# EasyEDA Pro project 3轴6.1--esp32 -(7-2).eprj, board PCB
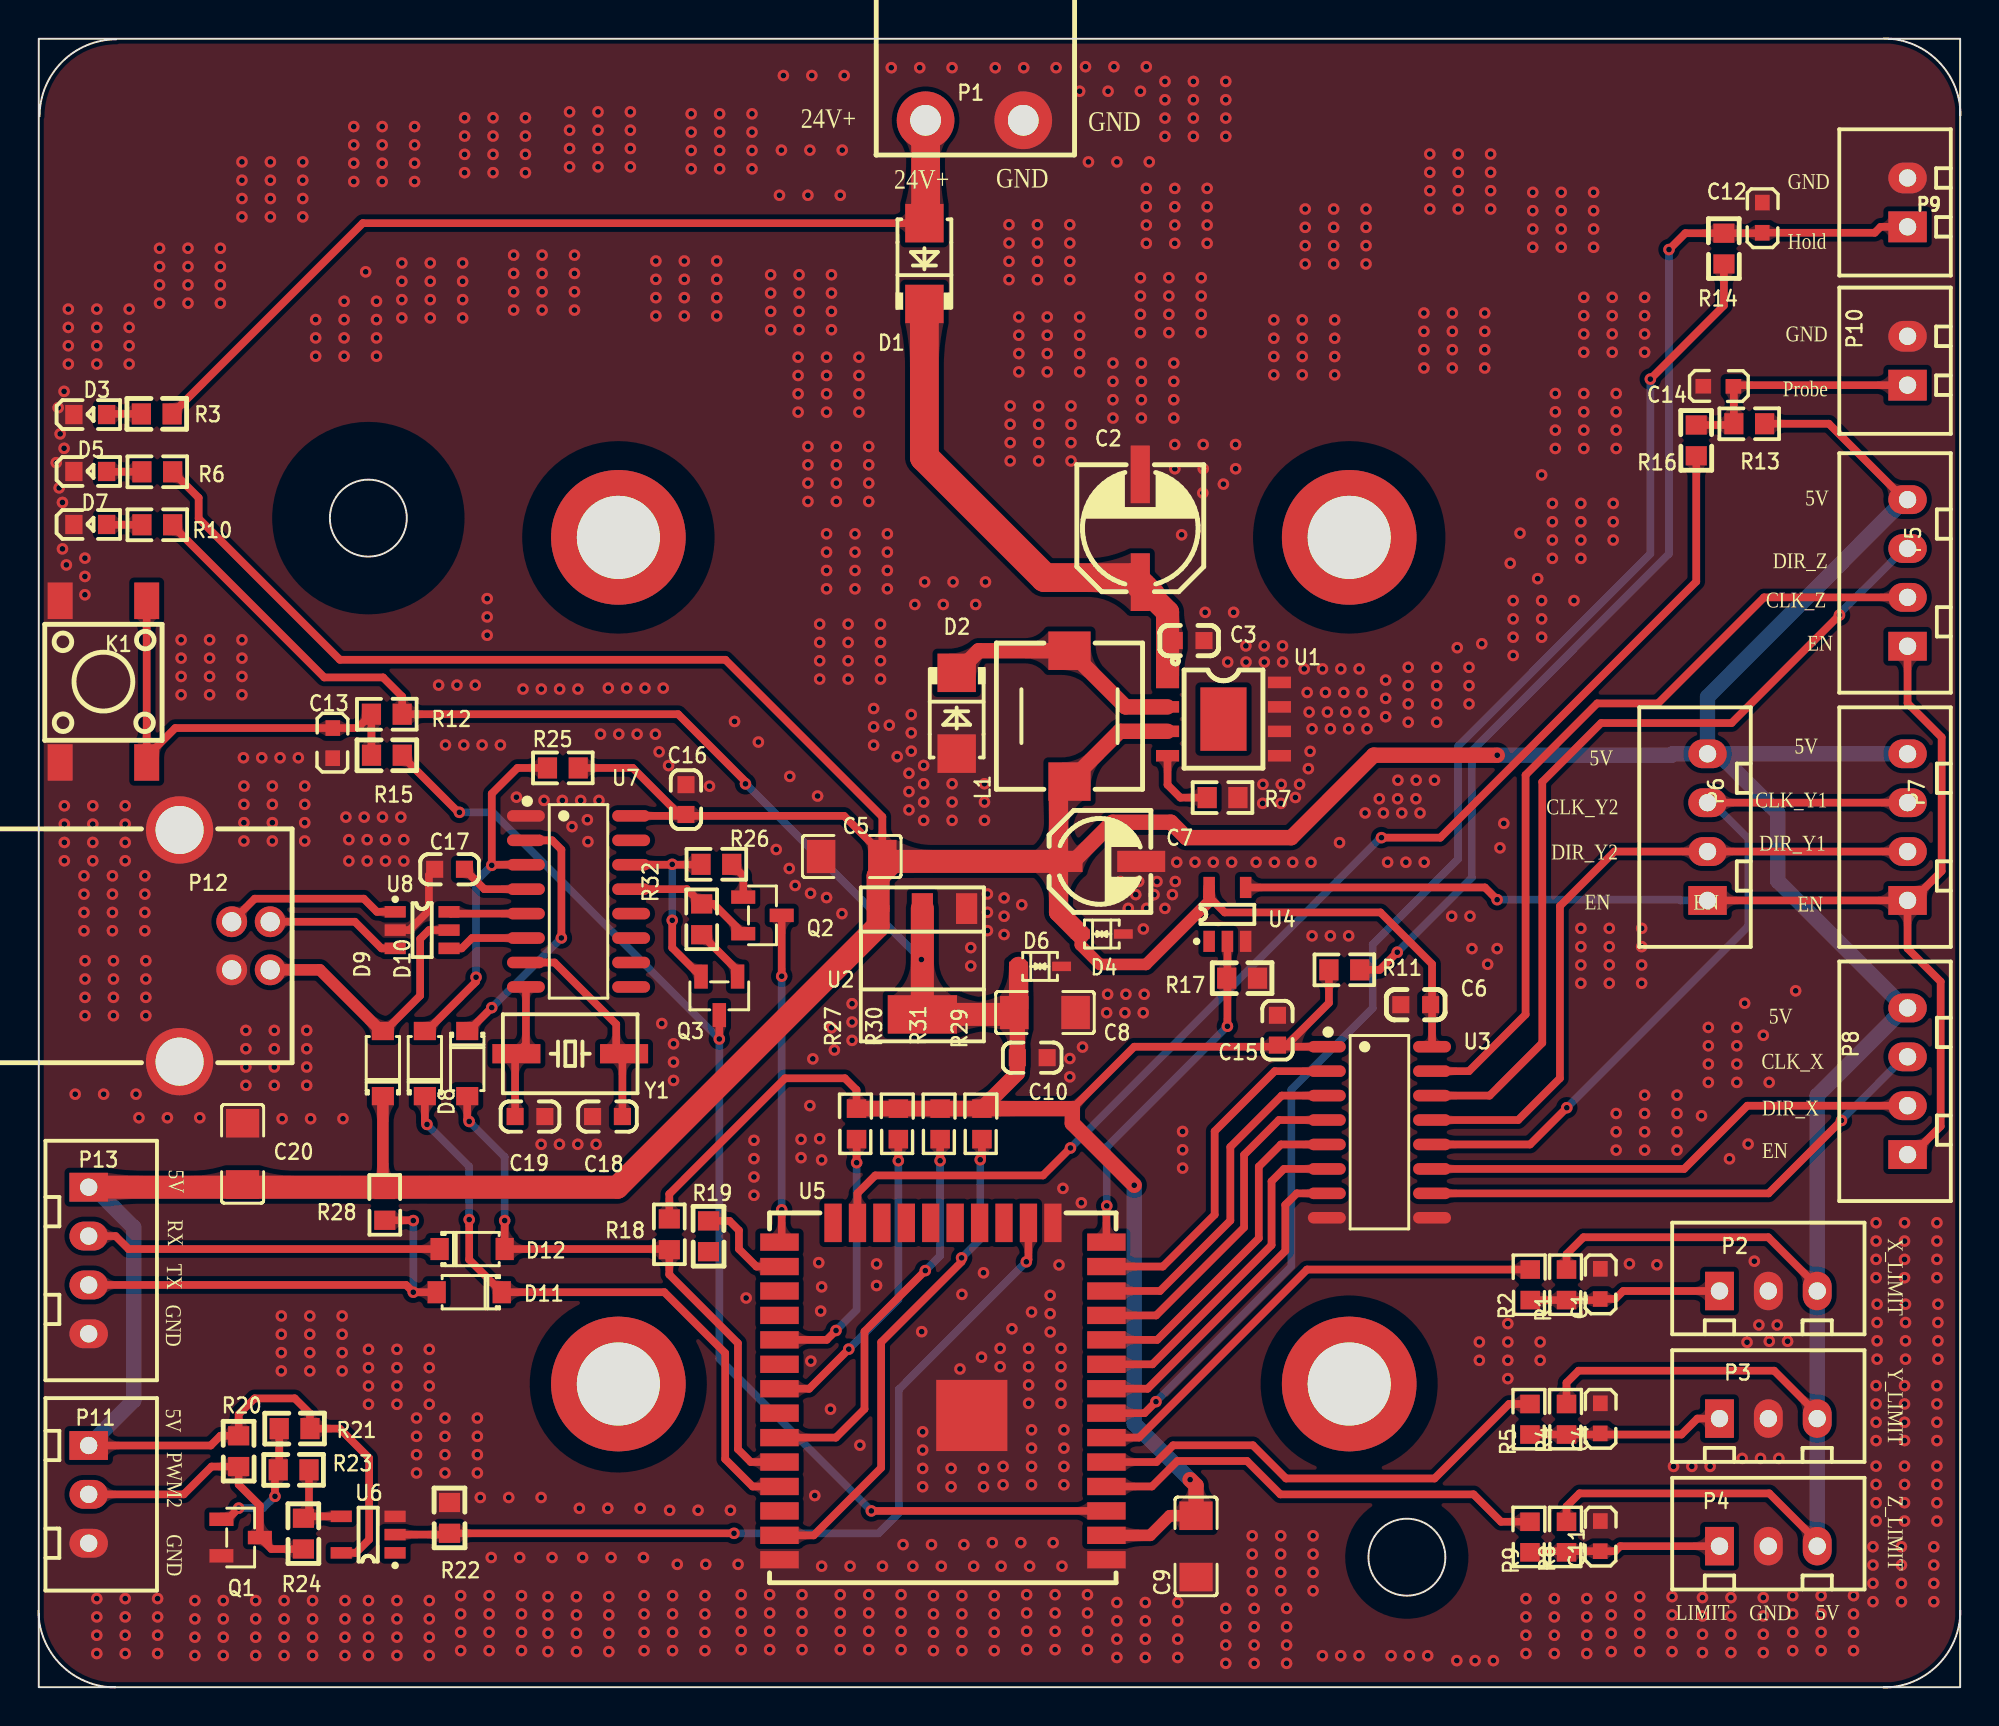
[diagram p1: board, top side]
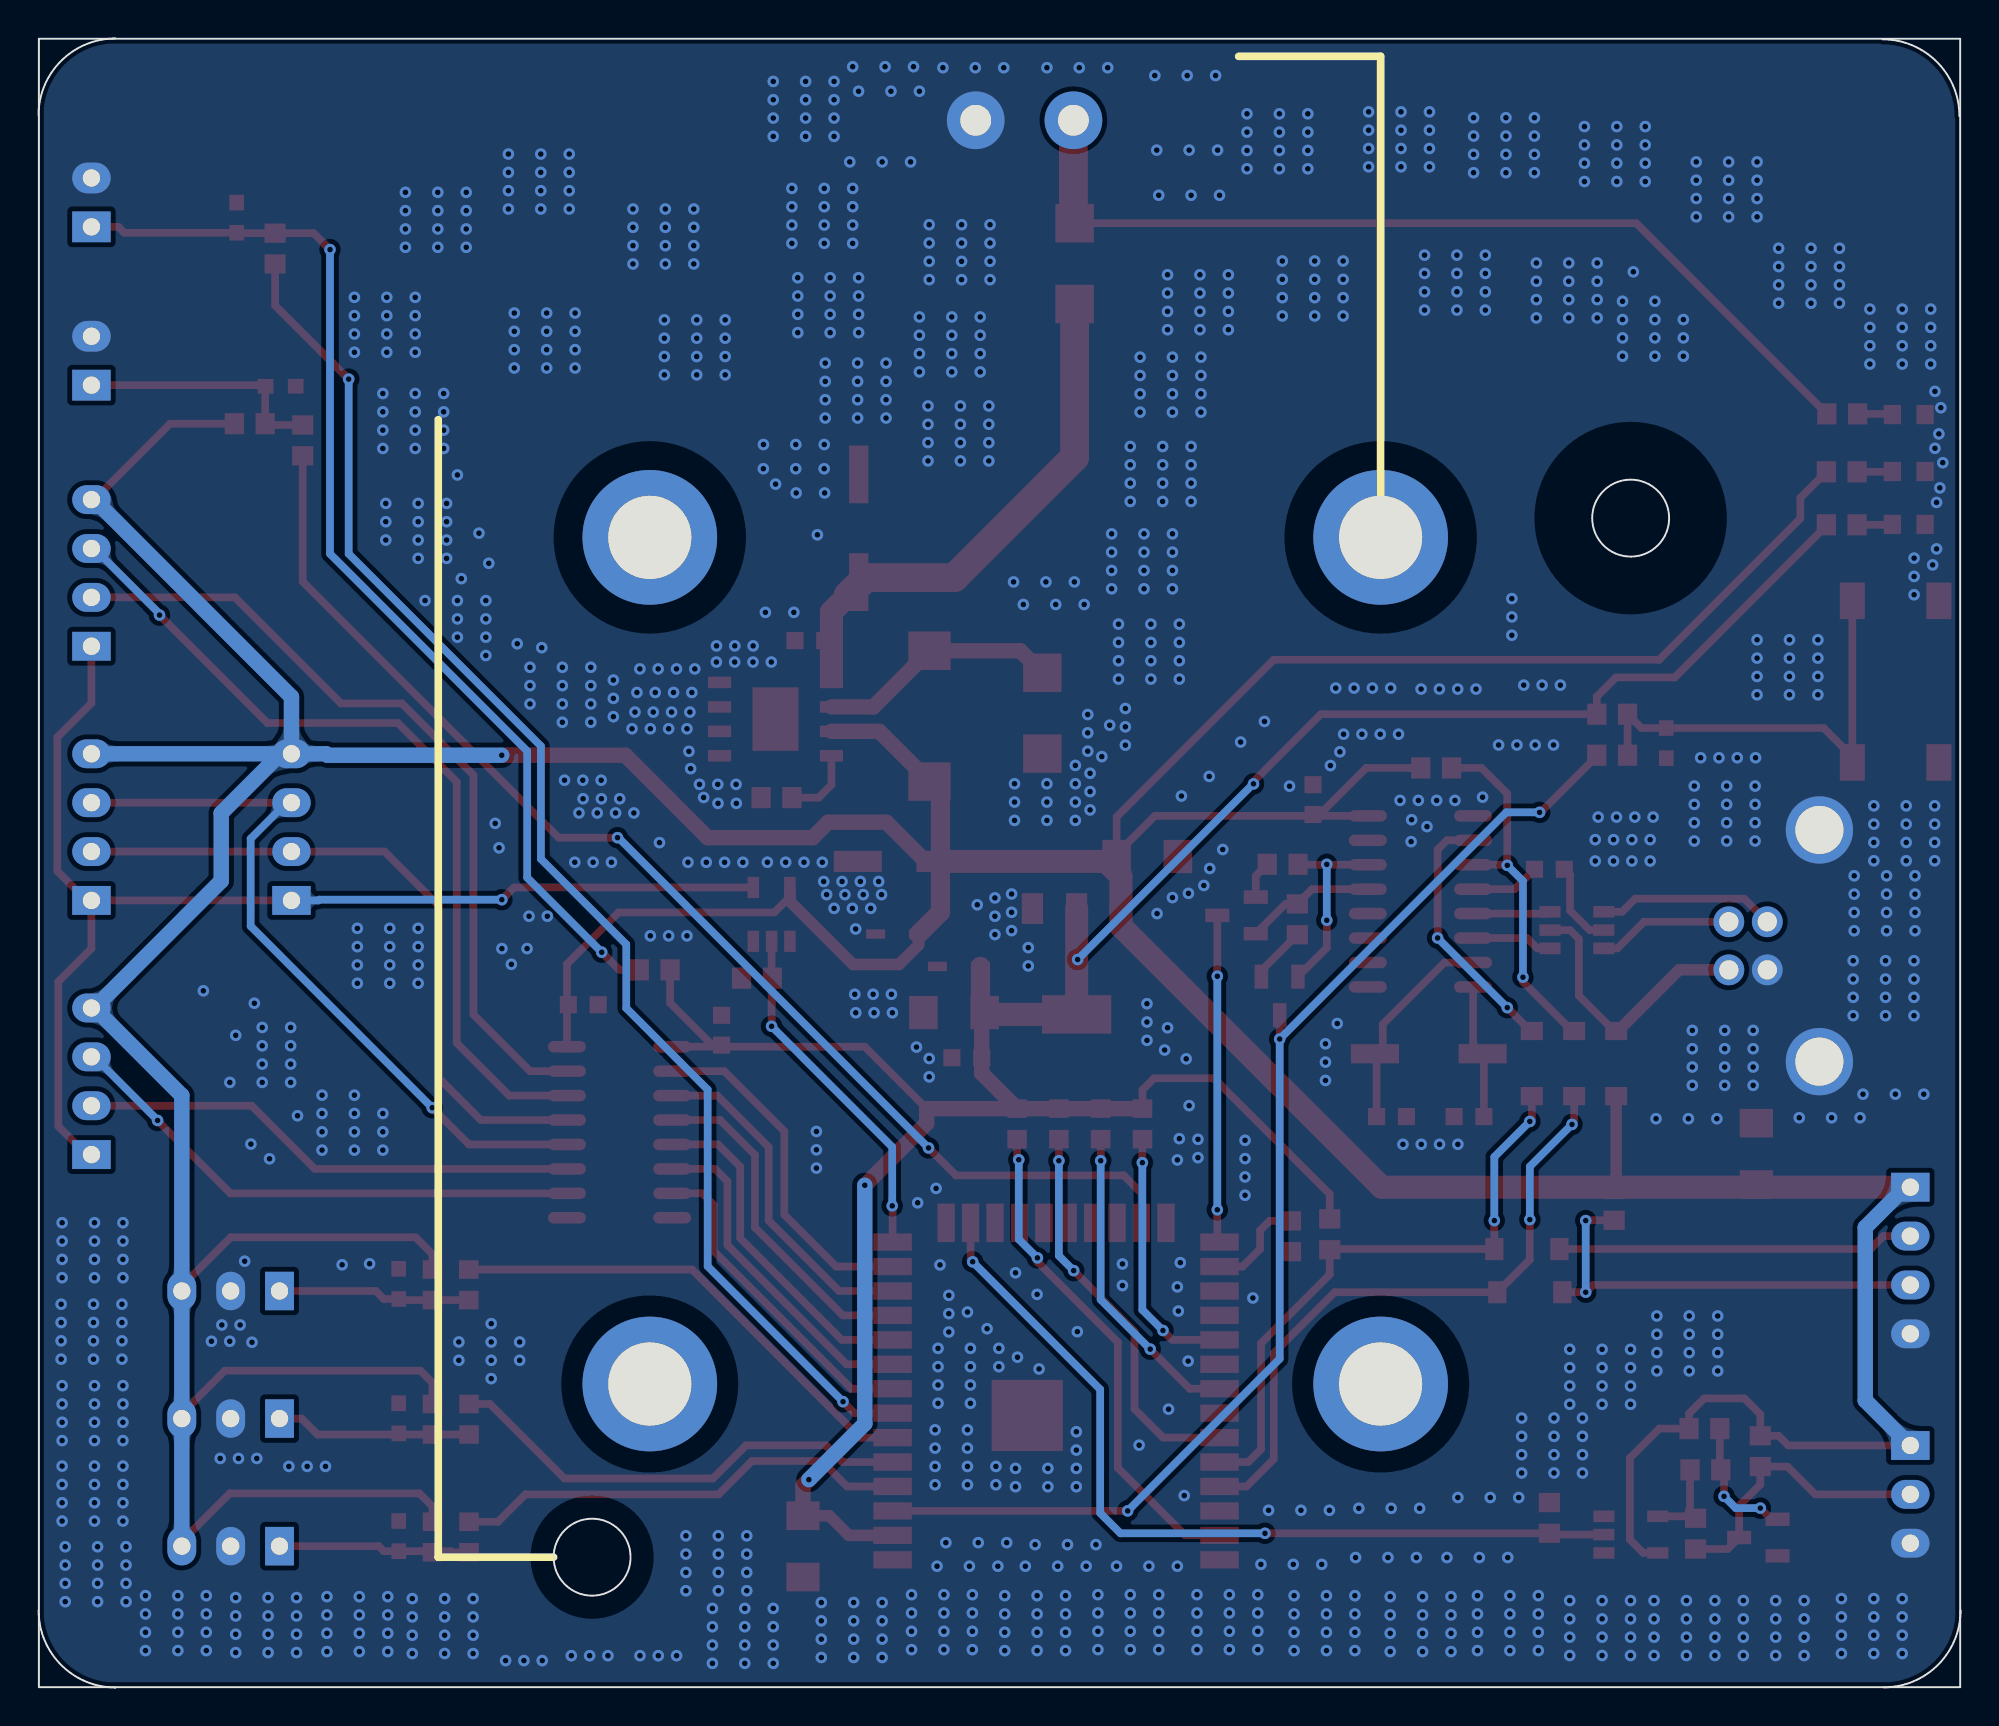
[diagram p2: board, bottom side, seen from below]

Outline 99.94 x 85.7 mm; copper layers: Top Layer, Bottom Layer. Coordinates in mm from the lower left corner of the outline.
Outline path: rectangle 0.02,85.69 99.92,0.02 ; circle c17.15,60.77 r2 ; circle c71.15,6.77 r2 ; 0.06,81.66 arc(1.23,84.49) 4.06,85.66 ; 4,0.01 arc(1.17,1.18) 0,4.01 ; 95.94,85.7 arc(98.77,84.53) 99.94,81.7 ; 99.93,4 arc(98.76,1.17) 95.93,0
Stack: Top Layer 0.035mm / Dielectric1 1.51mm FR4 er 4.5 / Bottom Layer 0.035mm

## Design rules (mm)
template: 用户自定义配置
spacing Default (default): track to track 0.152, other pairs 0 to 0.152
track width Default (default): min 0.254, default 0.254, max 25.4
differential pair differentialPair (default): width min 0.127, default 0.254, max 2.54; gap min 0.152, default 0.152
via Default (default): diameter min 0.25, default 0.61, max 100.025; hole min 0.2, default 0.305, max 59.995

## Placement (name value [footprint] x y rotation side)
C1  103  [11]  81.51 21.72 90 top
C2  100uF/35V  [电解电容贴片6X6]  57.29 60.25 90 top
C3  104  [0603C]  59.83 54.41 180 top
C4  103  [11]  81.51 14.73 90 top
C5  10uF  [C1206]  42.29 43.19 180 top
C6  104  [0603C]  71.61 35.49 0 top
C7  100uF/10V  [CAP-SMD_BD5.0-L5.3-W5.3-RD]  55.19 42.93 180 top
C8  4.7uF  [C1206]  52.33 35.08 180 top
C9  4.7uF  [C1206]  60.19 7.33 90 top
C10  104  [0603C]  51.67 32.73 180 top
C11  103  [11]  81.51 8.61 90 top
C12  103  [11]  89.93 77.13 90 top
C13  103  [11]  15 48.34 270 top
C14  103  [11]  86.61 67.92 180 top
C15  104  [0603C]  64.42 34.16 90 top
C16  104  [0603C]  33.67 46.15 90 top
C17  104  [0603C]  21.38 42.53 180 top
C18  18pF  [0603C]  29.59 29.67 180 top
C19  18pF  [0603C]  25.56 29.67 0 top
C20  10uF  [C1206]  10.61 27.73 90 top
D1  SS56  [SMA]  46.06 74 90 top
D2  SS34  [SMA]  47.74 50.63 270 top
D3  绿光  [0603LED]  2.66 66.14 180 top
D4  PESD5V0L1BA-N  [SOD-323_L1.8-W1.3-LS2.5-BI]  55.29 39.16 180 top
D5  绿光  [0603LED]  2.66 63.18 180 top
D6  PESD3V3L1BA-N  [SOD-323_L1.8-W1.3-LS2.5-BI]  52.08 37.48 180 top
D7  绿光  [0603LED]  2.66 60.43 180 top
D8  1N4148  [SOD-123_L2.8-W1.8-LS3.7-RD]  22.29 32.43 270 top
D9  1N4148  [SOD-123_L2.8-W1.8-LS3.7-RD]  17.91 32.43 90 top
D10  1N4148  [SOD-123_L2.8-W1.8-LS3.7-RD]  20.09 32.43 90 top
D11  1N4148  [SOD-123_L2.8-W1.8-LS3.7-RD]  22.4 20.54 180 top
D12  1N4148  [SOD-123_L2.8-W1.8-LS3.7-RD]  22.55 22.79 0 top
K1  SW_6X6_H=12.0MM  [KEY-SMD_4P-L6.0-W6.0-P4.50-LS9.0]  3.38 52.28 90 top
L1  68uH  [IND-SMD_L7.0-W7.0_SMDRI74-330MT]  53.61 50.48 90 top
NOREF  -  [Pad_ie446]  30.15 59.77 90 top
NOREF#2  -  [Pad_ie447]  68.15 15.77 90 top
NOREF#3  -  [Pad_ie445]  30.15 15.77 90 top
NOREF#4  -  [Pad_ie444]  68.15 59.77 90 top
P1  WJ2EDGR-5.08-2P  [CONN-TH_WJ2EDGR-5.08-2P]  48.67 81.45 180 top
P2  3P  [HDR1X3_CON]  89.95 20.61 0 top
P3  3P  [HDR1X3_CON]  89.95 13.98 0 top
P4  3P  [HDR1X3_CON]  89.95 7.35 0 top
P5  4P  [HDR1X4_CON]  97.18 54.11 90 top
P6  4P  [HDR1X4_CON]  86.78 40.91 90 top
P7  4P  [HDR1X4_CON]  97.18 40.91 90 top
P8  4P  [HDR1X4_CON]  97.18 27.7 90 top
P9  2P  [HDR1X2_CON]  97.18 77.18 90 top
P10  2P  [HDR1X2_CON]  97.18 68.95 90 top
P11  3P  [HDR1X3_CON]  2.61 10.04 270 top
P12  USB-B10-BRW  [USB-B-TH_USB-B10-BRW]  9.69 38.55 270 top
P13  4P  [HDR1X4_CON]  2.61 26 270 top
Q1  SS8050  [SOT-23-3_L2.9-W1.3-P1.90-LS2.4-BR]  10.51 7.79 180 top
Q2  SS8050  [SOT-23-3_L2.9-W1.3-P1.90-LS2.4-BR]  37.64 40.13 180 top
Q3  SS8050  [SOT-23-3_L2.9-W1.3-P1.90-LS2.4-BR]  35.4 35.95 90 top
R1  20K  [10]  79.57 20.03 90 top
R2  100  [10]  77.68 20.03 90 top
R3  47K  [0603R]  6.15 66.19 0 top
R4  20K  [10]  79.57 13.05 90 top
R5  100  [10]  77.67 13.05 90 top
R6  10K  [0603R]  6.18 63.18 0 top
R7  10K  [0603R]  61.56 46.25 0 top
R8  20K  [10]  79.57 6.93 90 top
R9  100  [10]  77.67 6.93 90 top
R10  10K  [0603R]  6.18 60.43 0 top
R11  10K  [0603R]  67.9 37.3 0 top
R12  10K  [0603R]  18.11 50.58 180 top
R13  10K  [0603R]  88.95 65.68 180 top
R14  100  [0603R]  87.63 74.78 90 top
R15  100  [0603R]  18.12 48.45 180 top
R16  100  [0603R]  86.2 64.81 90 top
R17  10K  [0603R]  62.58 36.86 0 top
R18  10K  [0603R]  32.8 23.55 270 top
R19  0Ω  [0603R]  34.84 23.45 270 top
R20  10K  [0603R]  10.41 12.28 90 top
R21  10K  [0603R]  13.32 13.46 0 top
R22  10K  [0603R]  21.38 8.81 90 top
R23  1K  [0603R]  13.27 11.31 180 top
R24  0Ω  [0603R]  13.78 8 90 top
R25  10K  [0603R]  27.27 47.79 0 top
R26  10K  [0603R]  35.25 42.78 0 top
R27  10K  [10]  42.65 28.4 90 top
R28  10K  [0603R]  18.01 25.08 90 top
R29  10K  [10]  49.17 28.4 90 top
R30  10K  [10]  44.83 28.4 90 top
R31  10K  [10]  47 28.4 90 top
R32  10K  [0603R]  34.48 39.92 270 top
U1  XL1509-5.0E1//SXL1509-5.0E1  [ESOP-8_L4.9-W3.9-P1.27-LS6.0-BL-EP]  61.61 50.33 270 top
U2  1117-3.3  [SOT-223]  45.96 37.78 180 top
U3  CA-IS3760  [SOIC-16_L9.9-W3.9-P1.27-LS6.0-BL]  69.72 28.86 270 top
U4  74LVC1G04  [SOT-23-5]  61.82 40.18 90 top
U5  ESP32-WROOM-32  [WIFI-SMD_ESP32-WROOM-32UE-A]  47.03 15.39 180 top
U6  74LVC1G04  [SOT-23-5]  17.14 7.95 180 top
U7  CH340G  [SOIC-16_L9.9-W3.9-P1.27-LS6.0-BL]  28.08 40.85 270 top
U8  USBLC2-2SC6  [SOT-23-6]  19.95 39.36 0 top
Y1  12M  [晶振贴片49SSMD]  27.65 32.94 0 top

## Footprints (pads in the part's own frame, mm; a bottom-side part is the same pattern mirrored in y, then rotated)
10
  rect 0.965x1.016 smd: 1(0.101,0.117) 2(1.688,0.117)
11
  rect 0.813x0.762 smd: 1(0.043,0.296) 2(-1.524,0.301)
0603C
  rect 0.889x0.889 smd: 1(-0.774,0) 2(0.774,0)
0603LED
  rect 0.9x1 smd: 1(-0.884,-0.017) 2(0.816,-0.017)
0603R
  rect 1x1.1 smd: 1(-0.8,0) 2(0.8,0)
C1206
  rect 1.485x1.728 smd: 1(-1.593,0) 2(1.593,0)
CAP-SMD_BD5.0-L5.3-W5.3-RD
  rect 2.5x1.1 smd: 1(2.15,0) 2(-2.15,0)
CONN-TH_WJ2EDGR-5.08-2P
  round 3 hole 1.6: 1(-2.54,0) 2(2.54,0)
ESOP-8_L4.9-W3.9-P1.27-LS6.0-BL-EP
  rect 0.6x1.2 smd: 1(-1.905,-2.909) 2(-0.635,-2.909) 3(0.635,-2.909) 4(1.905,-2.909) 5(1.905,2.909) 6(0.635,2.909) 7(-0.635,2.909) 8(-1.905,2.909)
  rect 3.3x2.4 smd: 9(0,0)
HDR1X2_CON
  rect 1.6x2 hole 0.9: 1(-1.27,0)
  oval 1.6x2 hole 0.9: 2(1.27,0)
HDR1X3_CON
  rect 1.5x2 hole 0.9: 1(-2.54,0)
  oval 1.5x2 hole 0.9: 2(0,0) 3(2.54,0)
HDR1X4_CON
  rect 1.5x2 hole 0.9: 1(0,0)
  oval 1.5x2 hole 0.9: 2(2.54,0) 3(5.08,0) 4(7.62,0)
IND-SMD_L7.0-W7.0_SMDRI74-330MT
  rect 2x2.2 smd: 1(-3.4,0) 2(3.4,0)
KEY-SMD_4P-L6.0-W6.0-P4.50-LS9.0
  rect 1.9x1.3 smd: 1(-4.2,2.25) 2(4.2,2.25) 3(-4.2,-2.25) 4(4.2,-2.25)
Pad_ie444
  round 7 hole 4.32: 0(0,0)
Pad_ie445
  round 7 hole 4.32: 0(0,0)
Pad_ie446
  round 7 hole 4.32: 0(0,0)
Pad_ie447
  round 7 hole 4.32: 0(0,0)
SMA
  rect 2x2 smd: 1(2.1,0) 2(-2.1,0)
SOD-123_L2.8-W1.8-LS3.7-RD
  rect 0.95x1.15 smd: 1(-1.692,0) 2(1.692,0)
SOD-323_L1.8-W1.3-LS2.5-BI
  rect 0.986x0.49 smd: 1(-1.117,0) 2(1.117,0)
SOIC-16_L9.9-W3.9-P1.27-LS6.0-BL
  oval 0.602x1.971 smd: 1(-4.445,-2.736) 2(-3.175,-2.736) 3(-1.905,-2.736) 4(-0.635,-2.736) 5(0.635,-2.736) 6(1.905,-2.736) 7(3.175,-2.736) 8(4.445,-2.736) 9(4.445,2.736) 10(3.175,2.736) 11(1.905,2.736) 12(0.635,2.736) 13(-0.635,2.736) 14(-1.905,2.736) 15(-3.175,2.736) 16(-4.445,2.736)
SOT-23-3_L2.9-W1.3-P1.90-LS2.4-BR
  rect 1.25x0.7 smd: 1(1,-0.95) 2(1,0.95) 3(-1,0)
SOT-23-5
  rect 1.1x0.6 smd: 1(-1.4,0.95) 2(-1.4,0) 3(-1.4,-0.95) 4(1.4,-0.95) 5(1.4,0.95)
SOT-23-6
  rect 1.1x0.6 smd: 1(-1.4,0.95) 2(-1.4,0) 3(-1.4,-0.95) 4(1.4,-0.95) 5(1.4,0) 6(1.4,0.95)
SOT-223
  rect 1.1x1.6 smd: 1(-2.3,-2.7) 2(0,-2.7) 3(2.3,-2.7)
  rect 3.6x2 smd: 4(0,2.8)
USB-B-TH_USB-B10-BRW
  round 1.6 hole 1: 1(1.25,2.355) 2(-1.25,2.355) 3(-1.25,0.355) 4(1.25,0.355)
  round 3.5 hole 2.5: 5(-6.02,-2.355) 6(6.02,-2.355)
WIFI-SMD_ESP32-WROOM-32UE-A
  rect 2x0.9 smd: 1(-8.5,8.755) 2(-8.5,7.485) 3(-8.5,6.215) 4(-8.5,4.945) 5(-8.5,3.675) 6(-8.5,2.405) 7(-8.5,1.135) 8(-8.5,-0.135) 9(-8.5,-1.405) 10(-8.5,-2.675) 11(-8.5,-3.945) 12(-8.5,-5.215) 13(-8.5,-6.485) 14(-8.5,-7.755) 25(8.5,-7.755) 26(8.5,-6.485) 27(8.5,-5.215) 28(8.5,-3.945) 29(8.5,-2.675) 30(8.5,-1.405) 31(8.5,-0.135) 32(8.5,1.135) 33(8.5,2.405) 34(8.5,3.675) 35(8.5,4.945) 36(8.5,6.215) 37(8.5,7.485) 38(8.5,8.755)
  rect 0.9x2 smd: 15(-5.715,-8.755) 16(-4.445,-8.755) 17(-3.175,-8.755) 18(-1.905,-8.755) 19(-0.635,-8.755) 20(0.635,-8.755) 21(1.905,-8.755) 22(3.175,-8.755) 23(4.445,-8.755) 24(5.715,-8.755)
  rect 3.7x3.7 smd: 39(-1.5,1.255)
晶振贴片49SSMD
  rect 2.5x1 smd: 1(-2.8,0) 2(2.8,0)
电解电容贴片6X6
  rect 3x1 smd: 1(-2.8,0) 2(2.8,0)

## Nets
As in the schematic.

Pads without a net: NOREF 0; NOREF#2 0; NOREF#3 0; NOREF#4 0; U1 9; U4 1; U5 17 18 19 20 21 22 32; U6 1; U7 9 10 11 12 15

## Via types
v1: diameter 0.6, hole 0.3, Top Layer to Bottom Layer, 1244 vias

## Routing (per net, layer and track width the routed paths; a pad name or vN(x,y) marks a point on that pad's centre or on a via; arc(x,y) is an arc through that point)
3V3: length 142
  Top Layer w0.4: R27.2 42.54,31.06 41.93,31.66 38.82,31.66 32.8,25.64 R18.1 ; R11.1 67.1,35.58 64.91,33.39 C15.1 ; v1(36.76,46.96) 36.76,47.08 33.26,50.58 R12.1 18.91,51.5 17.92,52.49 14.86,52.49 6.98,60.38 R10.2 ; 53.76,30.09 56.97,33.3 U3.1
  Top Layer w0.6: U5.2 57.8,7.91 58.82,8.93 60.19,8.93
  Top Layer w0.8: R29.2 53.76,30.09 53.76,29.32 v1(56.97,26.1) ; R29.2 R31.2 R30.2 R27.2 ; R29.2 50.89,31.93 C10.2 50.89,34.92 C8.2 ; v1(59.88,10.8) 60.19,10.5 60.19,8.93
  Top Layer w1: D6.2 50.96,35.3
  Top Layer w1.2: U2.2 U2.4 50.64,34.98 C8.2
  Bottom Layer w0.4: v1(45.91,37.83) 36.78,46.96 v1(36.76,46.96)
  Bottom Layer w0.8: v1(59.88,10.8) 56.97,13.71 v1(56.97,26.1)
5V_VCC: length 380.3
  Top Layer w0.4: P4.3 92.48,7.6 89.99,10.09 80.13,10.09 79.45,9.41 R8.2 ; U6.5 16.5,7 17.19,7.69 17.19,11.93 15.66,13.46 R21.2 14.12,14.24 13.33,15.03 11.24,15.03 10.41,14.2 R20.2 9.46,13.08 8.96,12.58 P11.1 ; U7.16 33.39,45.3 ; 33.39,45.3 41.89,45.3 43.88,43.31 ; 33.39,45.3 30.9,47.79 R25.2 ; 43.88,43.31 C5.1 ; 43.88,43.31 43.88,45.25 35.72,53.41 15.67,53.41 8.33,60.76 8.33,61.83 R6.2 ; U3.16 72.46,37.6 69.77,40.28 61.68,40.28 60.87,41.09 ; R1.2 79.45,22.52 80.33,23.4 89.94,23.4 92.48,20.86 P2.3 ; R4.2 79.45,15.84 80.08,16.46 90.25,16.46 92.48,14.23 P3.3 ; R13.1 93.09,65.68 97.04,61.73 97.29,61.73
  Top Layer w0.6: U4.5 60.87,40.86 57.59,37.58 55.19,37.58 54.17,38.59 D4.2 ; D9.1 17.91,26.08 17.99,26
  Top Layer w0.8: U1.3 56.22,49.69 L1.1 ; v1(75.85,48.45) 69.42,48.45 65.14,44.17 59.68,44.17 58.88,44.97 55.85,44.97 53.81,42.93 C7.1
  Top Layer w1: D4.2 53.04,40.29 C7.1 53.04,46.51 L1.1
  Top Layer w1.2: C7.1 44.43,42.93 43.66,42.16 U2.3 43.66,39.56 30.1,26 P13.1
  Bottom Layer w0.8: 97.04,35.32 92.48,30.77 P2.3 P3.3 P4.3 ; 97.04,35.32 97.29,35.32 ; 97.04,35.32 90.43,41.92 90.43,45.44 87.35,48.53 ; 86.78,48.53 84.98,48.53 84.91,48.45 v1(75.85,48.45) ; 86.78,48.53 87.35,48.53 ; 86.78,48.53 86.78,51.48 97.04,61.73 97.29,61.73 ; 87.35,48.53 97.29,48.53 ; P13.1 2.86,26 4.95,23.91 4.95,14.92 P11.1
24V: length 48.6
  Top Layer w0.4: 6.95,66.19 16.86,76.1 D1.1
  Top Layer w1.5: P1.2 46.13,76.16 D1.1
GND: length 4.4
  Top Layer w0.4: C17.2 20.3,42.23 20.3,40.38 19.28,39.36 U8.2
  vias: v1(0.92,63.65) v1(1.03,66.51) v1(1.08,62.35) v1(1.13,65.15) v1(1.25,61.59) v1(1.25,59.17) v1(1.33,67.36) v1(1.33,64.4) v1(1.35,45.82) v1(1.35,44.87) v1(1.35,43.92) v1(1.35,42.97) v1(1.45,58.34) v1(1.55,71.64) v1(1.55,70.68) v1(1.55,69.73) v1(1.55,68.78) v1(1.91,30.84) v1(2.37,42.19) v1(2.37,41.23) v1(2.37,40.28) v1(2.37,39.33) v1(2.42,58.69) v1(2.42,57.74) v1(2.42,56.79) v1(2.42,37.77) v1(2.42,36.82) v1(2.42,35.87) v1(2.42,34.92) v1(2.83,45.82) v1(2.83,44.87) v1(2.83,43.92) v1(2.83,42.97) v1(3.03,71.64) v1(3.03,70.68) v1(3.03,69.73) v1(3.03,68.78) v1(3.03,4.62) v1(3.03,3.67) v1(3.03,2.72) v1(3.03,1.77) v1(3.39,30.84) v1(3.85,42.19) v1(3.85,41.23) v1(3.85,40.28) v1(3.85,39.33) v1(3.9,37.77) v1(3.9,36.82) v1(3.9,35.87) v1(3.9,34.92) v1(4.51,45.82) v1(4.51,44.87) v1(4.51,43.92) v1(4.51,42.97) v1(4.51,4.62) v1(4.51,3.67) v1(4.51,2.72) v1(4.51,1.77) v1(4.72,71.64) v1(4.72,70.68) v1(4.72,69.73) v1(4.72,68.78) v1(5.07,30.84) v1(5.22,29.61) v1(5.53,42.19) v1(5.53,41.23) v1(5.53,40.28) v1(5.53,39.33) v1(5.58,37.77) v1(5.58,36.82) v1(5.58,35.87) v1(5.58,34.92) v1(6.19,4.62) v1(6.19,3.67) v1(6.19,2.72) v1(6.19,1.77) v1(6.3,74.8) v1(6.3,73.85) v1(6.3,72.89) v1(6.3,71.94) v1(6.7,29.61) v1(7.42,54.45) v1(7.42,53.5) v1(7.42,52.55) v1(7.42,51.59) v1(7.78,74.8) v1(7.78,73.85) v1(7.78,72.89) v1(7.78,71.94) v1(8.13,4.52) v1(8.13,3.57) v1(8.13,2.62) v1(8.13,1.66) v1(8.39,29.61) v1(8.9,54.45) v1(8.9,53.5) v1(8.9,52.55) v1(8.9,51.59) v1(9.46,74.8) v1(9.46,73.85) v1(9.46,72.89) v1(9.46,71.94) v1(9.61,4.52) v1(9.61,3.57) v1(9.61,2.62) v1(9.61,1.66) v1(10.58,79.29) v1(10.58,78.33) v1(10.58,77.38) v1(10.58,76.43) v1(10.58,54.45) v1(10.58,53.5) v1(10.58,52.55) v1(10.58,51.59) v1(10.66,48.32) v1(10.68,46.85) v1(10.68,45.9) v1(10.68,44.95) v1(10.68,43.99) v1(10.78,34.15) v1(10.78,33.2) v1(10.78,32.25) v1(10.78,31.3) v1(11.29,4.52) v1(11.29,3.57) v1(11.29,2.62) v1(11.29,1.66) v1(11.61,48.32) v1(12.06,79.29) v1(12.06,78.33) v1(12.06,77.38) v1(12.06,76.43) v1(12.16,46.85) v1(12.16,45.9) v1(12.16,44.95) v1(12.16,43.99) v1(12.26,34.15) v1(12.26,33.2) v1(12.26,32.25) v1(12.26,31.3) v1(12.56,48.32) v1(12.67,29.56) v1(12.63,19.31) v1(12.63,18.36) v1(12.63,17.41) v1(12.63,16.45) v1(12.77,4.52) v1(12.77,3.57) v1(12.77,2.62) v1(12.77,1.66) v1(13.51,48.32) v1(13.74,79.29) v1(13.74,78.33) v1(13.74,77.38) v1(13.74,76.43) v1(13.84,46.85) v1(13.84,45.9) v1(13.84,44.95) v1(13.84,43.99) v1(13.95,34.15) v1(13.95,33.2) v1(13.95,32.25) v1(13.95,31.3) v1(14.11,19.31) v1(14.11,18.36) v1(14.11,17.41) v1(14.11,16.45) v1(14.15,29.56) v1(14.25,4.52) v1(14.25,3.57) v1(14.25,2.62) v1(14.25,1.66) v1(14.41,71.09) v1(14.41,70.14) v1(14.41,69.19) v1(15.79,19.31) v1(15.79,18.36) v1(15.79,17.41) v1(15.79,16.45) v1(15.89,72.04) v1(15.89,71.09) v1(15.89,70.14) v1(15.89,69.19) v1(15.83,29.56) v1(15.98,45.24) v1(15.94,4.52) v1(15.94,3.57) v1(15.94,2.62) v1(15.94,1.66) v1(16.14,44.06) v1(16.14,42.95) v1(16.39,81.12) v1(16.39,80.17) v1(16.39,79.22) v1(16.39,78.27) v1(17.01,73.57) v1(16.94,45.24) v1(17.09,44.06) v1(17.09,42.95) v1(17.16,17.58) v1(17.16,16.62) v1(17.16,15.67) v1(17.16,14.72) v1(17.16,4.52) v1(17.16,3.57) v1(17.16,2.62) v1(17.16,1.66) v1(17.58,72.04) v1(17.58,71.09) v1(17.58,70.14) v1(17.58,69.19) v1(17.87,81.12) v1(17.87,80.17) v1(17.87,79.22) v1(17.87,78.27) v1(17.89,45.24) v1(18.04,44.06) v1(18.04,42.95) v1(18.64,17.58) v1(18.64,16.62) v1(18.64,15.67) v1(18.64,14.72) v1(18.64,4.52) v1(18.64,3.57) v1(18.64,2.62) v1(18.64,1.66) v1(18.89,74.03) v1(18.89,73.08) v1(18.89,72.13) v1(18.89,71.18) v1(18.84,45.24) v1(18.99,44.06) v1(18.99,42.95) v1(19.56,81.12) v1(19.56,80.17) v1(19.56,79.22) v1(19.56,78.27) v1(19.66,14.01) v1(19.66,13.05) v1(19.66,12.1) v1(19.66,11.15) v1(20.37,74.03) v1(20.37,73.08) v1(20.37,72.13) v1(20.37,71.18) v1(20.32,17.58) v1(20.32,16.62) v1(20.32,15.67) v1(20.32,14.72) v1(20.32,4.52) v1(20.32,3.57) v1(20.32,2.62) v1(20.32,1.66) v1(20.81,52.09) v1(21.16,48.98) v1(21.14,14.01) v1(21.14,13.05) v1(21.14,12.1) v1(21.14,11.15) v1(21.76,52.09) v1(21.95,4.77) v1(21.95,3.82) v1(21.95,2.87) v1(21.95,1.92) v1(22.06,74.03) v1(22.06,73.08) v1(22.06,72.13) v1(22.06,71.18) v1(22.16,81.58) v1(22.16,80.63) v1(22.16,79.68) v1(22.16,78.73) v1(22.12,48.98) v1(22.71,52.09) v1(22.82,14.01) v1(22.82,13.05) v1(22.82,12.1) v1(22.82,11.15) v1(22.97,9.87) v1(23.07,48.98) v1(23.33,56.59) v1(23.33,55.64) v1(23.33,54.69) v1(23.43,4.77) v1(23.43,3.82) v1(23.43,2.87) v1(23.43,1.92) v1(23.54,6.76) v1(23.64,81.58) v1(23.64,80.63) v1(23.64,79.68) v1(23.64,78.73) v1(24.02,48.98) v1(24.45,9.87) v1(24.71,74.44) v1(24.71,73.49) v1(24.71,72.54) v1(24.71,71.59) v1(24.85,46.27) v1(25.02,6.76) v1(25.19,51.89) v1(25.12,4.77) v1(25.12,3.82) v1(25.12,2.87) v1(25.12,1.92) v1(25.32,81.58) v1(25.32,80.63) v1(25.32,79.68) v1(25.32,78.73) v1(26.19,74.44) v1(26.19,73.49) v1(26.19,72.54) v1(26.19,71.59) v1(26.14,51.89) v1(26.14,28.23) v1(26.14,9.87) v1(26.29,46.1) v1(26.49,4.72) v1(26.49,3.77) v1(26.49,2.82) v1(26.49,1.87) v1(26.7,6.76) v1(27.1,51.89) v1(27.09,28.23) v1(27.24,46.1) v1(27.61,81.89) v1(27.61,80.94) v1(27.61,79.98) v1(27.61,79.03) v1(27.74,44.74) v1(27.87,74.44) v1(27.87,73.49) v1(27.87,72.54) v1(27.87,71.59) v1(27.97,4.72) v1(27.97,3.77) v1(27.97,2.82) v1(27.97,1.87) v1(28.05,51.89) v1(28.04,28.23) v1(28.19,46.1) v1(28.12,9.31) v1(28.29,6.76) v1(28.54,45.1) v1(28.57,43.96) v1(28.99,28.23) v1(29.09,81.89) v1(29.09,80.94) v1(29.09,79.98) v1(29.09,79.03) v1(29.14,46.1) v1(29.22,49.54) v1(29.6,9.31) v1(29.63,51.94) v1(29.65,4.72) v1(29.65,3.77) v1(29.65,2.82) v1(29.65,1.87) v1(29.77,6.76) v1(30.17,49.54) v1(30.58,51.94) v1(30.78,81.89) v1(30.78,80.94) v1(30.78,79.98) v1(30.78,79.03) v1(31.13,49.54) v1(31.29,9.31) v1(31.45,6.76) v1(31.49,4.77) v1(31.49,3.82) v1(31.49,2.87) v1(31.49,1.92) v1(31.53,51.94) v1(32.1,74.14) v1(32.1,73.18) v1(32.1,72.23) v1(32.1,71.28) v1(32.08,49.54) v1(32.27,48.63) v1(32.41,34.51) v1(32.49,51.94) v1(32.76,47.91) v1(32.82,9.21) v1(32.97,4.77) v1(32.97,3.82) v1(32.97,2.87) v1(32.97,1.92) v1(33.02,33.45) v1(33.02,32.5) v1(33.02,31.55) v1(33.22,6.4) v1(33.58,74.14) v1(33.58,73.18) v1(33.58,72.23) v1(33.58,71.28) v1(33.94,81.79) v1(33.94,80.83) v1(33.94,79.88) v1(33.94,78.93) v1(34.3,9.21) v1(34.69,6.4) v1(34.65,4.77) v1(34.65,3.82) v1(34.65,2.87) v1(34.65,1.92) v1(34.89,46.84) v1(35.26,74.14) v1(35.26,73.18) v1(35.26,72.23) v1(35.26,71.28) v1(35.42,81.79) v1(35.42,80.83) v1(35.42,79.88) v1(35.42,78.93) v1(35.98,9.21) v1(36.19,50.21) v1(36.38,6.4) v1(36.54,4.83) v1(36.54,3.87) v1(36.54,2.92) v1(36.54,1.97) v1(36.79,20.24) v1(37.1,81.79) v1(37.1,80.83) v1(37.1,79.88) v1(37.1,78.93) v1(37.2,28.44) v1(37.2,27.49) v1(37.2,26.53) v1(37.2,25.58) v1(37.43,49.14) v1(38.07,73.42) v1(38.07,72.47) v1(38.07,71.52) v1(38.07,70.57) v1(38.02,4.83) v1(38.02,3.87) v1(38.02,2.92) v1(38.02,1.97) v1(38.36,43.55) v1(38.53,77.55) v1(38.63,79.9) v1(38.73,83.77) v1(39.07,47.35) v1(39.04,42.57) v1(39.34,41.68) v1(39.5,69.14) v1(39.5,68.19) v1(39.5,67.23) v1(39.5,66.28) v1(39.55,73.42) v1(39.55,72.47) v1(39.55,71.52) v1(39.55,70.57) v1(39.65,28.49) v1(39.65,27.54) v1(39.7,4.83) v1(39.7,3.87) v1(39.7,2.92) v1(39.7,1.97) v1(40.01,77.55) v1(40.01,64.5) v1(40.01,63.54) v1(40.01,62.59) v1(40.01,61.64) v1(40.11,79.9) v1(40.11,30.24) v1(40.21,83.77) v1(40.14,41.27) v1(40.16,16.96) v1(40.26,32.67) v1(40.36,9.98) v1(40.51,46.33) v1(40.57,22.08) v1(40.62,55.27) v1(40.62,54.31) v1(40.62,53.36) v1(40.62,52.41) v1(40.62,28.52) v1(40.67,19.56) v1(40.72,27.42) v1(40.72,20.82) v1(40.72,6.3) v1(40.98,69.14) v1(40.98,68.19) v1(40.98,67.23) v1(40.98,66.28) v1(40.98,59.96) v1(40.98,59) v1(40.98,58.05) v1(40.98,57.1) v1(40.98,41.05) v1(41.18,14.46) v1(41.23,73.42) v1(41.23,72.47) v1(41.23,71.52) v1(41.23,70.57) v1(41.23,34.29) v1(41.38,33.13) v1(41.49,64.5) v1(41.49,63.54) v1(41.49,62.59) v1(41.49,61.64) v1(41.69,77.55) v1(41.69,4.83) v1(41.69,3.87) v1(41.69,2.92) v1(41.69,1.97) v1(41.79,79.9) v1(41.78,40.22) v1(41.89,83.77) v1(42.1,55.27) v1(42.1,54.31) v1(42.1,53.36) v1(42.1,52.41) v1(42.2,6.3) v1(42.3,35.54) v1(42.3,34.58) v1(42.3,33.63) v1(42.46,59.96) v1(42.46,59) v1(42.46,58.05) v1(42.46,57.1) v1(42.66,69.14) v1(42.66,68.19) v1(42.66,67.23) v1(42.66,66.28) v1(42.71,12.59) v1(43.17,64.5) v1(43.17,63.54) v1(43.17,62.59) v1(43.17,61.64) v1(43.17,4.83) v1(43.17,3.87) v1(43.17,2.92) v1(43.17,1.97) v1(43.42,50.88) v1(43.42,49.93) v1(43.42,48.97) v1(43.58,22.01) v1(43.58,20.89) v1(43.78,55.27) v1(43.78,54.31) v1(43.78,53.36) v1(43.78,52.41) v1(43.88,6.3) v1(44.14,59.96) v1(44.14,59) v1(44.14,58.05) v1(44.14,57.1) v1(44.24,50.01) v1(44.34,84.18) v1(44.65,48.38) v1(44.85,4.83) v1(44.85,3.87) v1(44.85,2.92) v1(44.85,1.97) v1(44.95,7.43) v1(45.26,47.51) v1(45.26,46.56) v1(45.26,45.61) v1(45.38,50.57) v1(45.38,49.61) v1(45.38,48.66) v1(45.46,6.3) v1(45.57,56.28) v1(45.82,84.18) v1(45.92,18.49) v1(45.97,13.29) v1(45.97,12.34) v1(45.97,11.39) v1(45.97,10.44) v1(46.08,57.46) v1(46.03,47.92) v1(46.03,46.97) v1(46.03,46.02) v1(46.03,45.06) v1(46.43,7.43) v1(46.54,4.77) v1(46.54,3.82) v1(46.54,2.87) v1(46.54,1.92) v1(46.94,6.3) v1(47.05,56.28) v1(47.5,84.18) v1(47.5,46.97) v1(47.5,46.02) v1(47.5,45.06) v1(47.45,11.39) v1(47.45,10.44) v1(47.56,57.46) v1(47.91,16.56) v1(48.01,20.43) v1(48.01,4.77) v1(48.01,3.82) v1(48.01,2.87) v1(48.01,1.92) v1(48.12,7.43) v1(48.47,38.45) v1(48.47,37.5) v1(48.63,6.3) v1(48.73,56.28) v1(49.03,17.17) v1(49.19,46.97) v1(49.19,46.02) v1(49.19,45.06) v1(49.14,21.55) v1(49.14,11.39) v1(49.14,10.44) v1(49.24,57.46) v1(49.34,41.24) v1(49.34,40.29) v1(49.34,39.34) v1(49.6,7.53) v1(49.7,4.77) v1(49.7,3.82) v1(49.7,2.87) v1(49.7,1.92) v1(49.75,84.18) v1(50,17.63) v1(50,16.67) v1(50.05,6.3) v1(50.21,41.04) v1(50.21,40.08) v1(50.21,39.13) v1(50.16,11.49) v1(50.16,10.54) v1(50.46,76.02) v1(50.46,75.07) v1(50.46,74.12) v1(50.46,73.17) v1(50.52,66.6) v1(50.52,65.65) v1(50.52,64.7) v1(50.52,63.75) v1(50.62,18.65) v1(50.97,71.23) v1(50.97,70.28) v1(50.97,69.32) v1(50.97,68.37) v1(51.07,7.53) v1(51.13,40.68) v1(51.23,84.18) v1(51.38,4.83) v1(51.38,3.87) v1(51.38,2.92) v1(51.38,1.97) v1(51.48,17.63) v1(51.48,16.67) v1(51.48,15.72) v1(51.48,14.77) v1(51.53,6.3) v1(51.64,19.51) v1(51.64,13.39) v1(51.64,12.44) v1(51.64,11.49) v1(51.64,10.54) v1(51.94,76.02) v1(51.94,75.07) v1(51.94,74.12) v1(51.94,73.17) v1(52,66.6) v1(52,65.65) v1(52,64.7) v1(52,63.75) v1(52.45,71.23) v1(52.45,70.28) v1(52.45,69.32) v1(52.45,68.37) v1(52.6,20.38) v1(52.6,19.43) v1(52.6,18.48) v1(52.76,7.53) v1(52.91,84.18) v1(52.86,4.83) v1(52.86,3.87) v1(52.86,2.92) v1(52.86,1.97) v1(53.06,21.96) v1(53.17,17.63) v1(53.17,16.67) v1(53.17,15.72) v1(53.17,14.77) v1(53.27,25.94) v1(53.22,6.3) v1(53.32,13.39) v1(53.32,12.44) v1(53.32,11.49) v1(53.32,10.54) v1(53.62,76.02) v1(53.62,75.07) v1(53.62,74.12) v1(53.62,73.17) v1(53.69,66.6) v1(53.69,65.65) v1(53.69,64.7) v1(53.69,63.75) v1(53.62,32.69) v1(53.62,31.74) v1(54.13,82.96) v1(54.13,71.23) v1(54.13,70.28) v1(54.13,69.32) v1(54.13,68.37) v1(54.29,33.28) v1(54.22,25.19) v1(54.44,84.23) v1(54.59,79.29) v1(54.54,4.83) v1(54.54,3.87) v1(54.54,2.92) v1(54.54,1.97) v1(55.61,82.96) v1(55.59,36.03) v1(55.54,35.07) v1(55.87,68.83) v1(55.87,67.88) v1(55.87,66.93) v1(55.87,65.97) v1(55.92,84.23) v1(56.07,79.29) v1(56.1,41.21) v1(56.07,4.42) v1(56.07,3.47) v1(56.07,2.51) v1(56.07,1.56) v1(56.25,41.89) v1(56.49,35.07) v1(56.54,36.03) v1(56.67,40.49) v1(57.05,41.21) v1(57.2,41.89) v1(57.3,82.96) v1(57.3,73.27) v1(57.3,72.32) v1(57.3,71.36) v1(57.3,70.41) v1(57.35,68.83) v1(57.35,67.88) v1(57.35,66.93) v1(57.35,65.97) v1(57.45,39.42) v1(57.49,36.03) v1(57.44,35.07) v1(57.6,84.23) v1(57.6,77.91) v1(57.6,76.96) v1(57.6,76.01) v1(57.6,75.05) v1(57.55,4.42) v1(57.55,3.47) v1(57.55,2.51) v1(57.55,1.56) v1(57.62,40.49) v1(57.76,79.29) v1(58.01,41.21) v1(58.16,41.89) v1(58.57,83.47) v1(58.57,82.52) v1(58.57,81.56) v1(58.57,80.61) v1(58.57,40.49) v1(58.78,73.27) v1(58.78,72.32) v1(58.78,71.36) v1(58.78,70.41) v1(58.96,41.21) v1(59.08,77.91) v1(59.08,76.96) v1(59.08,76.01) v1(59.08,75.05) v1(59.03,68.83) v1(59.03,67.88) v1(59.03,66.93) v1(59.03,65.97) v1(59.08,64.6) v1(59.09,63.34) v1(59.06,62.08) v1(59.11,41.89) v1(59.18,42.89) v1(59.23,4.42) v1(59.23,3.47) v1(59.23,2.51) v1(59.23,1.56) v1(59.44,59.91) v1(59.49,28.9) v1(59.49,27.95) v1(59.49,26.99) v1(60.05,83.47) v1(60.05,82.52) v1(60.05,81.56) v1(60.05,80.61) v1(60.13,42.89) v1(60.46,73.27) v1(60.46,72.32) v1(60.46,71.36) v1(60.46,70.41) v1(60.56,64.6) v1(60.57,63.34) v1(60.54,62.08) v1(60.66,55.88) v1(60.76,77.91) v1(60.76,76.96) v1(60.76,76.01) v1(60.76,75.05) v1(61.09,42.89) v1(61.61,62.54) v1(61.73,83.47) v1(61.73,82.52) v1(61.73,81.56) v1(61.73,80.61) v1(61.73,4.11) v1(61.73,3.16) v1(61.73,2.21) v1(61.73,1.26) v1(61.83,53.29) v1(62.04,42.89) v1(62.14,55.88) v1(62.24,64.6) v1(62.25,63.34) v1(62.78,54.13) v1(62.79,53.29) v1(63.11,7.89) v1(63.11,6.93) v1(63.11,5.98) v1(63.11,5.03) v1(63.21,4.11) v1(63.21,3.16) v1(63.21,2.21) v1(63.21,1.26) v1(63.31,42.89) v1(63.67,46.94) v1(63.65,45.95) v1(63.73,54.13) v1(63.74,53.29) v1(64.23,71.08) v1(64.23,70.12) v1(64.23,69.17) v1(64.23,68.22) v1(64.26,42.89) v1(64.61,45.95) v1(64.59,7.89) v1(64.59,6.93) v1(64.59,5.98) v1(64.59,5.03) v1(64.68,54.13) v1(64.69,53.29) v1(64.62,46.94) v1(64.9,4.11) v1(64.9,3.16) v1(64.9,2.21) v1(64.9,1.26) v1(65.21,42.89) v1(65.35,46.26) v1(65.57,46.94) v1(65.71,71.08) v1(65.71,70.12) v1(65.71,69.17) v1(65.71,68.22) v1(65.81,52.94) v1(65.86,76.84) v1(65.86,75.89) v1(65.86,74.93) v1(65.86,73.98) v1(65.97,51.71) v1(66.07,50.69) v1(66.03,47.75) v1(66.12,48.65) v1(66.17,42.89) v1(66.22,49.83) v1(66.22,39.06) v1(66.27,7.89) v1(66.27,6.93) v1(66.27,5.98) v1(66.27,5.03) v1(66.76,52.94) v1(66.76,1.65) v1(66.92,51.71) v1(67.02,50.69) v1(67.17,49.83) v1(67.17,39.06) v1(67.34,76.84) v1(67.34,75.89) v1(67.34,74.93) v1(67.34,73.98) v1(67.39,71.08) v1(67.39,70.12) v1(67.39,69.17) v1(67.39,68.22) v1(67.65,43.91) v1(67.71,1.65) v1(67.72,52.94) v1(67.87,51.71) v1(67.97,50.69) v1(68.12,49.83) v1(68.12,39.06) v1(68.67,52.94) v1(68.66,1.65) v1(68.82,51.71) v1(68.92,50.69) v1(68.98,45.45) v1(69.03,76.84) v1(69.03,75.89) v1(69.03,74.93) v1(69.03,73.98) v1(69.08,49.83) v1(69.72,46.19) v1(69.93,45.45) v1(70.05,52.36) v1(70.05,51.41) v1(70.05,50.45) v1(70.15,42.89) v1(70.33,1.65) v1(70.68,47.15) v1(70.67,46.19) v1(70.88,45.45) v1(71.1,42.89) v1(71.22,53.02) v1(71.22,52.07) v1(71.22,51.12) v1(71.22,50.17) v1(71.28,1.65) v1(71.63,47.15) v1(71.62,46.19) v1(71.84,45.45) v1(72.04,71.43) v1(72.04,70.48) v1(72.04,69.53) v1(72.04,68.58) v1(72.05,42.89) v1(72.23,1.65) v1(72.34,79.69) v1(72.34,78.74) v1(72.34,77.79) v1(72.34,76.84) v1(72.59,47.15) v1(72.7,53.02) v1(72.7,52.07) v1(72.7,51.12) v1(72.7,50.17) v1(73.52,71.43) v1(73.52,70.48) v1(73.52,69.53) v1(73.52,68.58) v1(73.48,40.08) v1(73.77,54.04) v1(73.75,1.4) v1(73.82,79.69) v1(73.82,78.74) v1(73.82,77.79) v1(73.82,76.84) v1(74.38,53.02) v1(74.38,52.07) v1(74.38,51.12) v1(74.43,40.08) v1(74.53,38.4) v1(74.7,1.4) v1(74.92,17.96) v1(74.92,17.01) v1(75.05,54.25) v1(75.2,71.43) v1(75.2,70.48) v1(75.2,69.53) v1(75.2,68.58) v1(75.35,37.59) v1(75.5,79.69) v1(75.5,78.74) v1(75.5,77.79) v1(75.5,76.84) v1(75.65,1.4) v1(75.84,38.4) v1(75.99,43.64) v1(76.19,44.91) v1(76.4,18.91) v1(76.4,17.96) v1(76.4,17.01) v1(76.4,16.05) v1(76.52,58.43) v1(76.68,56.49) v1(76.68,55.54) v1(76.68,54.58) v1(76.68,53.63) v1(77.03,59.99) v1(77.34,4.62) v1(77.34,3.67) v1(77.34,2.72) v1(77.34,1.77) v1(77.7,77.71) v1(77.7,76.75) v1(77.7,75.8) v1(77.7,74.85) v1(77.95,57.63) v1(78.08,17.96) v1(78.08,17.01) v1(78.16,63.02) v1(78.16,56.49) v1(78.16,55.54) v1(78.16,54.58) v1(78.72,61.54) v1(78.72,60.59) v1(78.72,59.63) v1(78.72,58.68) v1(78.87,67.25) v1(78.87,66.3) v1(78.87,65.35) v1(78.87,64.39) v1(78.82,4.62) v1(78.82,3.67) v1(78.82,2.72) v1(78.82,1.77) v1(79.18,77.71) v1(79.18,76.75) v1(79.18,75.8) v1(79.18,74.85) v1(79.84,56.49) v1(80.2,61.54) v1(80.2,60.59) v1(80.2,59.63) v1(80.2,58.68) v1(80.2,39.45) v1(80.2,38.5) v1(80.2,37.55) v1(80.2,36.6) v1(80.35,72.25) v1(80.35,71.3) v1(80.35,70.34) v1(80.35,69.39) v1(80.35,67.25) v1(80.35,66.3) v1(80.35,65.35) v1(80.35,64.39) v1(80.5,4.62) v1(80.5,3.67) v1(80.5,2.72) v1(80.5,1.77) v1(80.86,77.71) v1(80.86,76.75) v1(80.86,75.8) v1(80.86,74.85) v1(81.67,39.45) v1(81.67,38.5) v1(81.67,37.55) v1(81.67,36.6) v1(81.78,4.72) v1(81.78,3.77) v1(81.78,2.82) v1(81.78,1.87) v1(81.83,72.25) v1(81.83,71.3) v1(81.83,70.34) v1(81.83,69.39) v1(81.88,61.54) v1(81.88,60.59) v1(81.88,59.63) v1(82.03,67.25) v1(82.03,66.3) v1(82.03,65.35) v1(82.03,64.39) v1(82.03,29.83) v1(82.03,28.88) v1(82.03,27.93) v1(82.72,22.02) v1(83.26,4.72) v1(83.26,3.77) v1(83.26,2.82) v1(83.26,1.87) v1(83.36,39.45) v1(83.36,38.5) v1(83.36,37.55) v1(83.36,36.6) v1(83.51,72.25) v1(83.51,71.3) v1(83.51,70.34) v1(83.51,69.39) v1(83.51,30.78) v1(83.51,29.83) v1(83.51,28.88) v1(83.51,27.93) v1(84.15,21.97) v1(84.94,4.72) v1(84.94,3.77) v1(84.94,2.82) v1(84.94,1.87) v1(85.02,11.49) v1(85.19,30.78) v1(85.19,29.83) v1(85.19,28.88) v1(85.19,27.93) v1(85.97,11.49) v1(86.47,29.71) v1(86.52,4.67) v1(86.52,3.72) v1(86.52,2.77) v1(86.52,1.82) v1(86.83,34.3) v1(86.83,33.35) v1(86.83,32.4) v1(86.83,31.45) v1(86.92,11.49) v1(87.92,27.48) v1(88,4.67) v1(88,3.72) v1(88,2.77) v1(88,1.82) v1(88.3,34.3) v1(88.3,33.35) v1(88.3,32.4) v1(88.3,31.45) v1(88.59,11.91) v1(88.71,35.56) v1(88.89,28.24) v1(88.84,17.94) v1(89.22,22.16) v1(89.45,18.84) v1(89.54,11.91) v1(89.68,33.9) v1(89.68,4.67) v1(89.68,3.72) v1(89.68,2.77) v1(89.68,1.82) v1(89.99,31.45) v1(89.99,17.99) v1(90.41,18.84) v1(90.49,11.91) v1(90.95,17.99) v1(91.21,4.77) v1(91.21,3.82) v1(91.21,2.87) v1(91.21,1.92) v1(91.36,36.21) v1(92.69,4.77) v1(92.69,3.82) v1(92.69,2.87) v1(92.69,1.92) v1(94.37,4.77) v1(94.37,3.82) v1(94.37,2.87) v1(94.37,1.92) v1(95.39,7.32) v1(95.39,6.36) v1(95.39,5.41) v1(95.39,4.46) v1(95.55,24.15) v1(95.55,23.2) v1(95.55,22.25) v1(95.55,21.3) v1(95.6,19.92) v1(95.6,18.97) v1(95.6,18.02) v1(95.6,17.07) v1(95.55,15.69) v1(95.55,14.74) v1(95.55,13.78) v1(95.55,12.83) v1(95.55,11.51) v1(95.55,10.55) v1(95.55,9.6) v1(95.55,8.65) v1(96.86,7.32) v1(96.86,6.36) v1(96.86,5.41) v1(96.86,4.46) v1(97.03,24.15) v1(97.03,23.2) v1(97.03,22.25) v1(97.03,21.3) v1(97.08,19.92) v1(97.08,18.97) v1(97.08,18.02) v1(97.08,17.07) v1(97.03,15.69) v1(97.03,14.74) v1(97.03,13.78) v1(97.03,12.83) v1(97.03,11.51) v1(97.03,10.55) v1(97.03,9.6) v1(97.03,8.65) v1(98.55,7.32) v1(98.55,6.36) v1(98.55,5.41) v1(98.55,4.46) v1(98.71,24.15) v1(98.71,23.2) v1(98.71,22.25) v1(98.71,21.3) v1(98.71,15.69) v1(98.71,14.74) v1(98.71,13.78) v1(98.71,12.83) v1(98.71,11.51) v1(98.71,10.55) v1(98.71,9.6) v1(98.71,8.65) v1(98.76,19.92) v1(98.76,18.97) v1(98.76,18.02) v1(98.76,17.07)
VIN_24V: length 27.3
  Top Layer w1.2: 57.84,56.76 58.71,55.89 58.71,52.57
  Top Layer w1.5: 57.84,56.76 56.92,57.68 52.32,57.68 46.06,63.94 D1.2
ESP_BOOT: length 17
  Top Layer w0.4: U5.25 38.64,23.26 v1(38.64,24.83) ; Q2.3 v1(38.64,36.97)
  Bottom Layer w0.4: v1(38.64,36.97) v1(38.64,24.83)
ESP_RST: length 63.9
  Top Layer w0.4: v1(21.89,45.48) 21.83,45.48 18.92,48.4 R15.1 ; v1(35.4,33.7) Q3.3 ; U5.3 v1(43.31,9.18)
  Bottom Layer w0.4: v1(43.31,9.18) 35.4,17.08 v1(35.4,33.7) 23.62,45.48 v1(21.89,45.48)
HOLD: length 74.2
  Top Layer w0.4: v1(58.11,14.86) 57.51,14.26 U5.7 ; R14.1 87.63,71.82 v1(83.81,68)
  Bottom Layer w0.4: v1(83.81,68) 83.81,58.92 73.81,48.92 73.81,43.06 69.38,38.62 69.38,35.31 65.14,31.07 65.14,21.89 v1(58.11,14.86)
M_EN_O: length 64.3
  Top Layer w0.4: v1(75.84,40.94) 75.21,41.58 U4.4 ; P5.1 97.18,51.16 98.96,49.38 98.96,42.43 97.43,40.91 P7.1 ; P7.1 97.18,38.41 98.91,36.68 98.91,29.17 97.43,27.7 P8.1 ; P7.1 P6.1
  Bottom Layer w0.4: v1(75.84,40.94) 85.34,40.94 85.38,40.91 P6.1
MOTOR_EN: length 18.2
  Top Layer w0.4: U5.14 55.53,25.02 v1(55.55,25.03) ; U4.2 v1(61.82,34.36)
  Bottom Layer w0.4: v1(55.55,25.03) 55.55,28.09 v1(61.82,34.36)
MX_DIR: length 17.9
  Top Layer w0.4: U5.12 58.31,20.61 61.97,24.27 61.97,28.09 64.64,30.76 U3.3
MX_STEP: length 18.2
  Top Layer w0.4: U3.2 64.28,32.03 61.16,28.91 61.16,24.57 58.46,21.88 U5.13
MY_DIR: length 17.8
  Top Layer w0.4: U3.5 64.6,28.22 63.45,27.07 63.45,23.35 58.17,18.07 U5.10
MY_STEP: length 17.9
  Top Layer w0.4: U5.11 58.11,19.34 62.69,23.91 62.69,27.68 64.49,29.49 U3.4
MZ_DIR: length 17.1
  Top Layer w0.4: U5.8 57.67,15.53 64.83,22.69 64.83,25.08 65.43,25.68 U3.7
MZ_STEP: length 17.6
  Top Layer w0.4: U3.6 64.76,26.95 64.11,26.31 64.11,22.99 57.92,16.8 U5.9
PROBE: length 64.9
  Top Layer w0.4: v1(53.66,28.04) 52.23,26.61 43.51,26.61 42.58,25.69 U5.23 ; v1(69.83,44.17) 72.89,44.17 86.2,57.47 R16.1
  Bottom Layer w0.4: v1(53.66,28.04) 69.79,44.17 v1(69.83,44.17)
PWM: length 44.5
  Top Layer w0.4: v1(51.36,22.12) 51.47,22.24 U5.16 ; U6.2 21.31,7.95 R22.1 v1(36.17,8.01)
  Bottom Layer w0.4: v1(36.17,8.01) 43.68,8.01 44.73,9.07 44.73,15.5 v1(51.36,22.12)
PWM_5V: length 4.5
  Top Layer w0.4: 14.07,8.81 14.15,8.9 U6.4 ; 14.07,8.81 R23.1 ; 14.07,8.81 14.05,8.8 13.78,8.8
PWM_OUT: length 15.1
  Top Layer w0.4: P11.2 7.55,10.04 9,11.48 R20.1 10.41,10.55 11.51,9.45 Q1.3 12.11,7.2 13.78,7.2
QB: length 5.2
  Top Layer w0.4: U5.26 37.33,21.88 36.42,22.79 36.42,23.76 35.93,24.25 R19.1
RXD: length 31.6
  Top Layer w0.4: D8.2 22.29,29.52 v1(22.4,29.42) ; U5.34 37.04,11.72 36.37,12.38 36.37,17.89 32.8,21.46 R18.2 32.77,22.79 D12.2 v1(24.24,24.27)
  Bottom Layer w0.4: v1(22.4,29.42) 24.24,27.57 v1(24.24,24.27)
SD_CD: length 20.7
  Top Layer w0.4: v1(46.11,21.67) 42.95,18.5 42.95,14.47 41.46,12.99 U5.33 ; R31.1 v1(46.88,27.38)
  Bottom Layer w0.4: v1(46.88,27.38) 46.88,22.44 v1(46.11,21.67)
SD_CS: length 13.5
  Top Layer w0.4: R27.1 42.54,28.49 v1(42.54,27.28) ; v1(41.47,18.56) 40.98,18.07 U5.29
  Bottom Layer w0.4: v1(42.54,27.28) 42.54,19.63 v1(41.47,18.56)
SD_MISO: length 16.4
  Top Layer w0.4: v1(42.13,17.59) 40.08,15.53 U5.31 ; R30.1 v1(44.71,27.38)
  Bottom Layer w0.4: v1(42.13,17.59) 44.71,20.16 v1(44.71,27.38)
SD_MOSI: length 26
  Top Layer w0.4: U5.37 40.31,7.91 43.82,11.41 43.82,17.94 48,22.12 v1(48,22.33) ; v1(48.97,27.43) 49.05,27.52 R29.1
  Bottom Layer w0.4: v1(48.97,27.43) 48.97,23.3 v1(48,22.33)
TXD: length 33.7
  Top Layer w0.4: D10.1 20.09,29.38 v1(20.2,29.27) ; v1(22.4,24.32) 22.4,22.24 D11.1 32.54,20.54 35.71,17.38 35.71,11.87 37.13,10.45 U5.35
  Bottom Layer w0.4: v1(20.2,29.27) 22.4,27.07 v1(22.4,24.32)
USB_DM: length 7.1
  Top Layer w0.4: P12.2 16.45,39.8 17.84,38.41 U8.3
USB_DP: length 9.3
  Top Layer w0.4: U8.1 17.6,40.31 16.92,41 11.25,41 P12.3
VUSB: length 14.4
  Top Layer w0.4: U8.5 20.3,39.36 19.85,38.9 19.85,35.96 18.01,34.12
  Top Layer w0.6: D9.2 17.81,34.12 14.63,37.3 P12.1
X_DIR_O: length 44.6
  Top Layer w0.4: U3.14 75.45,30.76 78.19,33.5 78.19,47.06 81.25,50.12 88.03,50.12 v1(93.64,55.73)
  Bottom Layer w0.4: 97.29,59.19 97.04,59.19 93.64,55.8 v1(93.64,55.73)
X_LIMT: length 25.7
  Top Layer w0.4: R2.2 65.95,21.72 57.22,12.99 U5.6
X_LIMT_I: length 10
  Top Layer w0.4: P2.1 82.4,20.61 81.98,20.19 81.2,20.19 81.15,20.13 R1.1 R2.1
X_STEP_O: length 42.3
  Top Layer w0.4: U3.15 74.38,32.03 77.32,34.98 77.32,47.42 81.05,51.14 84.21,51.14 89.72,56.65 97.29,56.65
Y_DIR_O: length 39.1
  Top Layer w0.4: U3.12 77.56,28.22 v1(79.47,30.13) ; P6.3 97.29,45.99
  Bottom Layer w0.4: P6.3 87.03,45.99 88.9,44.11 88.9,39.57 v1(79.47,30.13)
Y_LIMT: length 24.7
  Top Layer w0.4: U5.5 58.13,11.72 59,12.59 63.14,12.59 64.87,10.86 72.59,10.86 76.46,14.74 R5.2
Y_LIMT_I: length 10.2
  Top Layer w0.4: P3.1 86.26,13.98 85.43,13.15 R4.1 R5.1
Y_STEP_O: length 35.8
  Top Layer w0.4: 97.29,43.45 81.94,43.45 79.11,40.61 79.11,31.66 76.94,29.49 U3.13
Z_DIR_O: length 27.8
  Top Layer w0.4: v1(93.75,29.47) 89.96,25.68 U3.10
  Bottom Layer w0.4: 97.29,32.78 97.04,32.78 93.75,29.49 v1(93.75,29.47)
Z_LIMT: length 23.9
  Top Layer w0.4: U5.4 57.89,10.45 59.22,11.77 62.84,11.77 64.57,10.04 74.62,10.04 76.04,8.62 R9.2
Z_LIMT_I: length 10
  Top Layer w0.4: 77.55,7.03 78.46,7.03 78.52,7.09 81.98,7.09 82.25,7.35 P4.1
Z_STEP_O: length 26.2
  Top Layer w0.4: U3.11 85.57,26.95 88.85,30.24 97.29,30.24
$9N72390: length 12.6
  Top Layer w0.8: U1.2 56.53,50.96 L1.2 48.89,53.88 D2.2
$9N72392: length 3.8
  Top Layer w0.4: U1.4 58.71,46.91 59.37,46.25 R7.1
$9N72730: length 1.8
  Top Layer w0.4: R3.1 3.58,66.19 3.54,66.16
$9N85928: length 3.6
  Top Layer w0.4: U7.4 23.19,41.49 C17.1
$9N85949: length 4
  Top Layer w0.4: U7.5 21.44,40.22 U8.6
$9N85958: length 4.2
  Top Layer w0.4: U8.4 22.01,38.41 22.54,38.95 U7.6
$9N85962: length 10.9
  Top Layer w0.4: C18.1 30.36,32.85 Y1.2 ; U7.7 26.83,37.68 30.04,34.47 30.04,32.94
$9N85965: length 7
  Top Layer w0.4: 25.35,36.41 25.35,33.43 Y1.1 24.78,32.87 C19.1
$9N86544: length 13.5
  Top Layer w0.4: v1(23.57,35.33) 22.35,34.12 D8.1 ; v1(27.19,38.95) 27.19,43.55 26.71,44.03 U7.2
  Bottom Layer w0.4: v1(27.19,38.95) v1(23.57,35.33)
$9N86546: length 19.1
  Top Layer w0.4: R25.1 24.91,47.79 23.57,46.45 v1(23.57,42.73) 23.6,42.76 U7.3 ; D10.2 20.19,34.12 22.75,36.68 v1(22.75,36.92)
  Bottom Layer w0.4: v1(23.57,42.73) 22.75,41.91 v1(22.75,36.92)
$9N86982: length 6.8
  Top Layer w0.4: Q2.2 35.1,40.72 R32.1 33.72,41.49 U7.13
$9N86987: length 10.1
  Top Layer w0.4: 34.45,42.78 34.43,42.76 U7.14 ; Q3.2 32.95,38.44 v1(32.95,39.87)
  Bottom Layer w0.4: v1(32.95,39.87) v1(32.95,42.78)
$9N87254: length 23.5
  Top Layer w0.4: R28.1 19.47,24.28 v1(19.49,24.27) ; D11.2 v1(19.49,20.54) 19.11,20.92 P13.3
  Bottom Layer w0.4: v1(19.49,24.27) v1(19.49,20.54)
$9N87257: length 18.5
  Top Layer w0.4: P13.2 4.01,23.46 4.68,22.79 D12.1
$9N89334: length 1.9
  Top Layer w0.4: R26.2 36.64,42.18 Q2.1
$9N89338: length 3
  Top Layer w0.4: Q3.1 36.35,37.26 R32.2
$9N98710: length 23.1
  Top Layer w0.4: K1.4 5.63,48.38 ; 5.63,48.38 7.11,49.86 C13.2 16.59,49.86 R12.2 17.31,48.46 R15.2 ; 5.63,48.38 K1.3
$9N100484: length 13.1
  Top Layer w0.4: R16.2 88.08,65.61 R13.2 88.15,67.6 C14.2 88.19,67.68 97.29,67.68
$9N100840: length 1.8
  Top Layer w0.4: D7.1 3.56,60.43 R10.1
$9N100955: length 1.8
  Top Layer w0.4: D5.1 3.56,63.18 R6.1
$9N125401: length 6.9
  Top Layer w0.4: R21.1 12.52,11.31 ; v1(10.41,9.32) 9.83,8.74 9.51,8.74 ; R23.2 12.3,11.14 v1(12.3,9.94)
  Bottom Layer w0.4: v1(10.41,9.32) 11.69,9.32 v1(12.3,9.94)
$9N127736: length 57.6
  Top Layer w0.4: v1(84.78,74.73) 85.63,75.58 R14.2 89.61,75.58 C12.2 95.48,75.6 95.78,75.91 P9.1 ; R11.2 69.73,37.3 v1(70.65,38.21)
  Bottom Layer w0.4: v1(70.65,38.21) 74.53,42.09 74.53,48.67 84.78,58.92 v1(84.78,74.73)

## Copper pours and planes (outline as drawn; the poured copper is in the pictures)
GND on Top Layer: -2.02,87.07 101.81,87.07 101.81,-1.21 -2.02,-1.21
GND on Bottom Layer: -1.16,86.92 100.95,86.92 100.95,-1.11 -1.16,-1.11

Small or netless copper shapes (teardrops, artwork), in the pictures only: 307 on Top Layer, 63 on Bottom Layer

## Text on the board
Top Silkscreen Layer: CLK_Y2 | DIR_Y2 | EN | 5V | LIMIT | GND | CLK_Y1 | DIR_Y1 | CLK_X | DIR_X | CLK_Z | DIR_Z | TX | PWM2 | RX | X_LIMIT | Y_LIMIT | Z_LIMIT | Probe | Hold | 24V+
